# EAGLE design JMPM 001 (EAGLE 9.6.1)
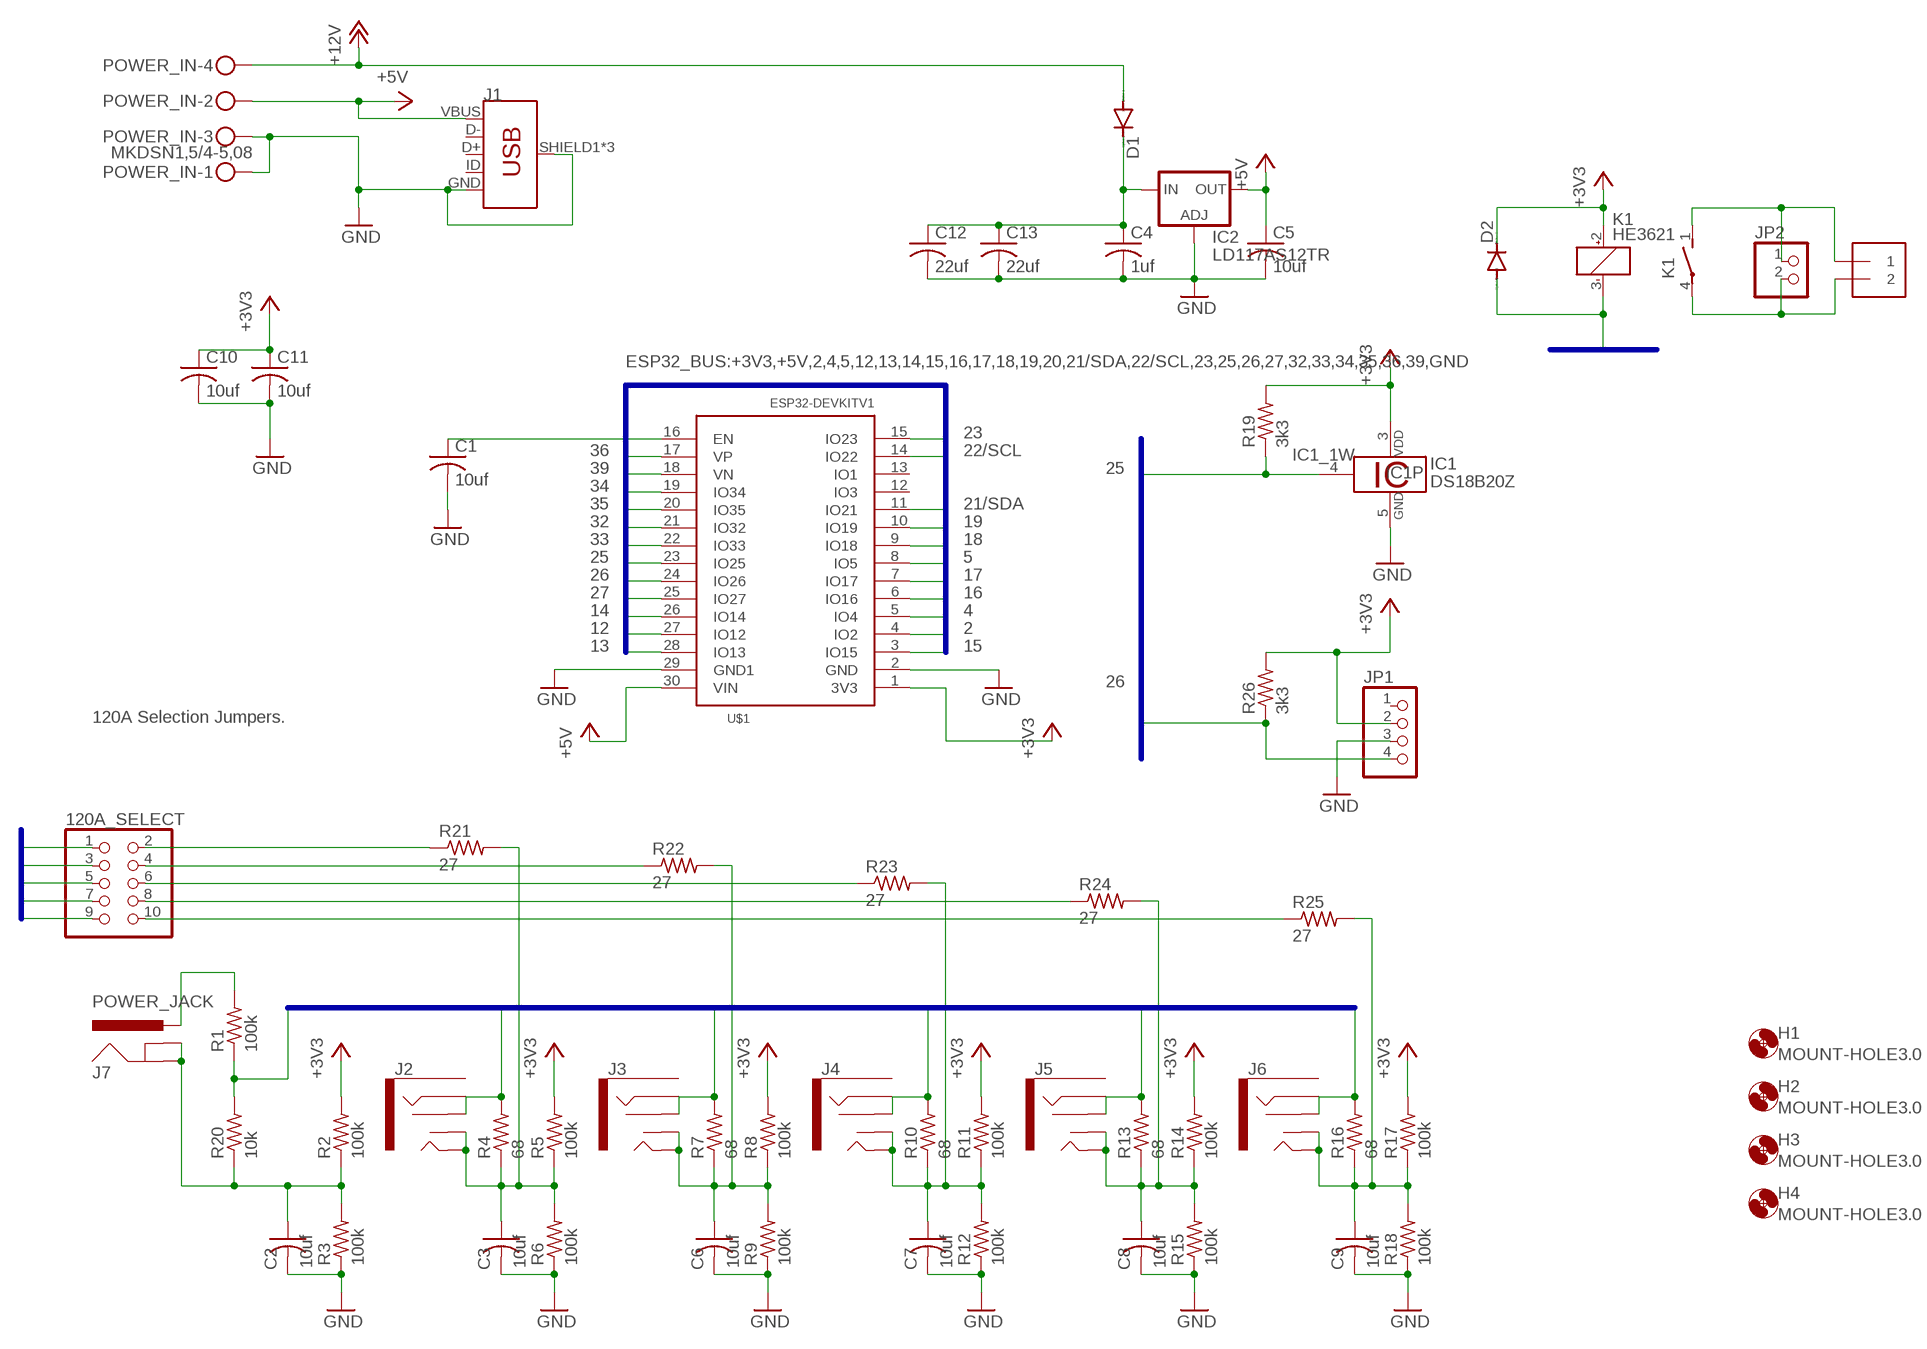
[diagram p0: schematic, sheet 1]

## Parts
120A_SELECT  PINHD-2X5  [2X05]
C1  10uf  C-USC0603  [C0603]
C2  10uf  C-USC0603  [C0603]
C3  10uf  C-USC0603  [C0603]
C4  1uf  C-USC0603  [C0603]
C5  10uf  C-USC0603  [C0603]
C6  10uf  C-USC0603  [C0603]
C7  10uf  C-USC0603  [C0603]
C8  10uf  C-USC0603  [C0603]
C9  10uf  C-USC0603  [C0603]
C10  10uf  C-USC0603  [C0603]
C11  10uf  C-USC0603  [C0603]
C12  22uf  C-USC0805  [C0805]
C13  22uf  C-USC0805  [C0805]
D1  DIODE-DO-214AC  [DO-214AC]
D2  DIODE-DO-214AC  [DO-214AC]
H1  MOUNT-HOLE3.0  [3,0]
H2  MOUNT-HOLE3.0  [3,0]
H3  MOUNT-HOLE3.0  [3,0]
H4  MOUNT-HOLE3.0  [3,0]
IC1  DS18B20Z  [SO08]
IC2  LD117AS12TR  [SOT223]
J1  USB_MICRO-BREDUCED_PASTE  [USB-B-MICRO-SMD_RED_PASTE]
J2  AUDIO_JACK_3.5MM_KIT  [AUDIO-JACK-KIT]
J3  AUDIO_JACK_3.5MM_KIT  [AUDIO-JACK-KIT]
J4  AUDIO_JACK_3.5MM_KIT  [AUDIO-JACK-KIT]
J5  AUDIO_JACK_3.5MM_KIT  [AUDIO-JACK-KIT]
J6  AUDIO_JACK_3.5MM_KIT  [AUDIO-JACK-KIT]
J7  POWER_JACK  [POWER_JACK_PTH]
JP1  PINHD-1X4/90  [1X04/90]
JP2  PINHD-1X2  [1X02]
JP2B  1X2-3.5MM  [1X2-3.5MM]
K1  HE3621  [HE3621]
POWER_IN  MKDSN1,5/4-5,08  [MKDSN1,5/4-5,08]
R1  100k  R-US_R0603  [R0603]
R2  100k  R-US_R0603  [R0603]
R3  100k  R-US_R0603  [R0603]
R4  68  R-US_R0603  [R0603]
R5  100k  R-US_R0603  [R0603]
R6  100k  R-US_R0603  [R0603]
R7  68  R-US_R0603  [R0603]
R8  100k  R-US_R0603  [R0603]
R9  100k  R-US_R0603  [R0603]
R10  68  R-US_R0603  [R0603]
R11  100k  R-US_R0603  [R0603]
R12  100k  R-US_R0603  [R0603]
R13  68  R-US_R0603  [R0603]
R14  100k  R-US_R0603  [R0603]
R15  100k  R-US_R0603  [R0603]
R16  68  R-US_R0603  [R0603]
R17  100k  R-US_R0603  [R0603]
R18  100k  R-US_R0603  [R0603]
R19  3k3  R-US_R0603  [R0603]
R20  10k  R-US_R0603  [R0603]
R21  27  R-US_R0603  [R0603]
R22  27  R-US_R0603  [R0603]
R23  27  R-US_R0603  [R0603]
R24  27  R-US_R0603  [R0603]
R25  27  R-US_R0603  [R0603]
R26  3k3  R-US_R0603  [R0603]
U$1  ESP32DEVKITV1  [ESP32-DEVKITV1]

## Nets
2: U$1.4(IO2)
4: U$1.5(IO4)
5: U$1.8(IO5)
12: U$1.27(IO12)
13: U$1.28(IO13)
14: U$1.26(IO14)
15: U$1.3(IO15)
16: U$1.6(IO16)
17: U$1.7(IO17)
18: U$1.9(IO18)
19: U$1.10(IO19)
21/SDA: U$1.11(IO21)
22/SCL: U$1.14(IO22)
23: U$1.15(IO23)
25: IC1.4 R19.1 U$1.23(IO25)
26: JP1.4 R26.1 U$1.24(IO26)
27: D2.A K1.3(1:-) U$1.25(IO27)
32: 120A_SELECT.7 J5.RING J5.RSH R13.2 U$1.21(IO32)
33: 120A_SELECT.9 J6.RING J6.RSH R16.2 U$1.22(IO33)
34: 120A_SELECT.3 J3.RING J3.RSH R7.2 U$1.19(IO34)
35: 120A_SELECT.5 J4.RING J4.RSH R10.2 U$1.20(IO35)
36: R1.1 R20.2 U$1.17(VP)
39: 120A_SELECT.1 J2.RING J2.RSH R4.2 U$1.18(VN)
+3V3 [3V3]: C10.1 C11.1 D2.C IC1.3 JP1.2 K1.2(1:+) R2.2 R5.2 R8.2 R11.2 R14.2 R17.2 R19.2 R26.2 U$1.1(3V3)
+5V [5V]: C5.1 IC2.4(OUT) J1.VBUS POWER_IN.2 U$1.30(VIN)
+12V [12V]: D1.A POWER_IN.4
GND [GND]: C1.2 C2.2 C3.2 C4.2 C5.2 C6.2 C7.2 C8.2 C9.2 C10.2 C11.2 C12.2 C13.2 IC1.5 IC2.1(ADJ) J1.GND J1.SHIELD1(SHIELD) J1.SHIELD2(SHIELD) J1.SHIELD3(SHIELD) JP1.3 POWER_IN.1 POWER_IN.3 R3.1 R6.1 R9.1 R12.1 R15.1 R18.1 U$1.2(GND) U$1.29(GND1)
N$1: C1.1 U$1.16(EN)
N$2 [12V]: C4.1 C12.1 C13.1 D1.C IC2.3(IN)
N$3: J7.PWR R1.2
N$4: JP2.1 JP2B.1 K1.1(2:S)
N$5: 120A_SELECT.2 R21.1
N$6: C2.1 J7.GND J7.GNDBREAK R2.1 R3.2 R20.1
N$7: 120A_SELECT.4 R22.1
N$8: C6.1 J3.TIP J3.TSH R7.1 R8.1 R9.2 R22.2
N$9: 120A_SELECT.6 R23.1
N$10: C7.1 J4.TIP J4.TSH R10.1 R11.1 R12.2 R23.2
N$11: 120A_SELECT.8 R24.1
N$12: C8.1 J5.TIP J5.TSH R13.1 R14.1 R15.2 R24.2
N$13: 120A_SELECT.10 R25.1
N$14: C9.1 J6.TIP J6.TSH R16.1 R17.1 R18.2 R25.2
N$15: C3.1 J2.TIP J2.TSH R4.1 R5.1 R6.2 R21.2
N$16: JP2.2 JP2B.2 K1.4(2:P)
Unconnected: J1.D+ J1.D- J1.ID J2.SLEEVE J3.SLEEVE J4.SLEEVE J5.SLEEVE J6.SLEEVE JP1.1 U$1.12(IO3) U$1.13(IO1)

## Buses
ESP32_BUS:+3V3,+5V,2,4,5,12,13,14,15,16,17,18,19,20,21/SDA,22/SCL,23,25,26,27,32,33,34,35,36,39,GND

## Notes on the sheet
- 120A Selection Jumpers.

## Library data of the parts
120A_SELECT = pinhead:PINHD-2X5: PIN HEADER
C1-C3 C5-C11 = rcl:C-US: CAPACITOR, American symbol; LCSC_PART_NUMBER: C19702; SPICEPREFIX: C
C4 = rcl:C-US: CAPACITOR, American symbol; LCSC_PART_NUMBER: C15849; SPICEPREFIX: C
C12 C13 = rcl:C-US: CAPACITOR, American symbol; LCSC_PART_NUMBER: C45783; SPICEPREFIX: C
D1 D2 = diode:DIODE-: DIODE; LCSC_PART_NUMBER: C95872
H1-H4 = holes:MOUNT-HOLE: MOUNTING HOLE with drill center marker
IC1 = 1wire:DS18B20: Programmable Resolution Digital Thermometer This chip provides a onewire thermosensor with approx. 0.5°C accuracy. A programmable over/undertemperure alarm is available. The precision can be set from 9..12 bits. Notes: Vdd must be applied for accurate measurements at low temperatures, as the parasite power circuit otherwise heats the sensor. If parasite power is used, Vdd has to be connected to GND. The DS1822 is a low-cost thermometer chip, the DS18S20 is similar to the DS18B20, but with 9 Bit precision only. Author: Jan Kandziora <jjj@gmx.de>; LCSC_PART_NUMBER: C97190
IC2 = v-reg:LD117A?*: Low drop fixed and adjustable positive voltage regulators 1 A Source: http://www.st.com/stonline/products/literature/ds/7194/ld1117axx.pdf; ALT: LDL1117S50R‎; LCSC_PART_NUMBER: C6187; PRICE: 0.5
J1 = SparkFun-Connectors:USB_MICRO-B: USB Type Micro-B Connector Male/female and PTH/SMT variants SparkFun Products: SparkFun microB USB Breakout <https://www.sparkfun.com/products/12035> SparkFun USB microB Plug Breakout <https://www.sparkfun.com/products/10031> SparkFun ESP8266 Thing <https://www.sparkfun.com/products/13231>; PROD_ID: CONN-11752
J2-J6 = SparkFun-Connectors:AUDIO_JACK_3.5MM: Audio Jack 3.5mm variants of PTH and SMT stereo audio jack with bypass switches. SparkFun Products: SparkFun SparkPunk Sound Kit <[https://www.sparkfun.com/products/11177]> - PTH MP3 Trigger <https://www.sparkfun.com/products/13720> -3.5mm SMD SparkFun PicoBoard <https://www.sparkfun.com/products/11888>- 2.5mm SMD; PROD_ID: CONN-08774; SF_ID: PRT-08032
J7 = SparkFun-Connectors:POWER_JACK: Power Jack Connector This is the standard 5.5mm barrel jack for power. The PTH is the most common, proven, reliable, footprint. The Slot footprint only works if the mill layer is transmitted to the PCB fab house so be warned. Here are the connectors we sell at SparkFun: DC Barrel Power Jack/Connector <https://www.sparkfun.com/products/119> (PRT-00119) DC Barrel Power Jack/Connector (SMD) <https://www.sparkfun.com/products/12748> (PRT-12748) DC Barrel Jack Adapter - Breadboard Compatible <https://www.sparkfun.com/products/10811> (PRT-10811) It is used on this SparkFun product (and many, many others): SparkFun RedBoard - Programmed with Arduino <https://www.sparkfun.com/products/12757> (DEV-12757) Also, if you need a mating power supply or connector, please check these out: Wall Adapter Power Supply - 9VDC 650mA <https://www.sparkfun.com/products/298> (TOL-00298) DC Barrel Jack Adapter - Male <https://www.sparkfun.com/products/10287> (PRT-10287); PROD_ID: CONN-08197
JP1 = pinhead:PINHD-1X4: PIN HEADER
JP2 = pinhead:PINHD-1X2: PIN HEADER
JP2B = adafruit:1X2: 3.5mm Terminal block http://www.ladyada.net/library/pcb/eaglelibrary.html; MPN: OSTTE020161
K1 = relay:HE3621: RELAY reed, 1 x norm. open, grid 5.08 mm, Hamlin; MF: HAMLIN; MPN: HE3621A0510; OC_FARNELL: 9561943; OC_NEWARK: 50F7993
POWER_IN = con-phoenix-508:MKDSN1,5/4-5,08: MKDSN 1,5/ 4-5,08 Printklemme Nennstrom: 13,5 A Nennspannung: 250 V Rastermaß: 5,08 mm Polzahl: 4 Anschlussart: Schraubanschluss Montage: Löten Anschlussrichtung Leiter/Platine: 0 ° Artikelnummer: 1729144 Source: http://eshop.phoenixcontact.com .. 1729144.pdf
R1-R3 R5 R6 R8 R9 R11 R12 R14 R15 R17 R18 = rcl:R-US_: RESISTOR, American symbol; LCSC_PART_NUMBER: C25803; SPICEPREFIX: R
R4 R7 R10 R13 R16 = rcl:R-US_: RESISTOR, American symbol; LCSC_PART_NUMBER: C27592; SPICEPREFIX: R
R19 R26 = rcl:R-US_: RESISTOR, American symbol; LCSC_PART_NUMBER: C22978; SPICEPREFIX: R
R20 = rcl:R-US_: RESISTOR, American symbol; LCSC_PART_NUMBER: C25804; SPICEPREFIX: R
R21-R25 = rcl:R-US_: RESISTOR, American symbol; LCSC_PART_NUMBER: C25190; SPICEPREFIX: R
U$1 = ESP32-DEVKITV1:ESP32DEVKITV1

## Net classes
0 default: width 0.305 mm, clearance 0.356 mm
1 GND: width 0.508 mm, clearance 0.356 mm
2 12V: width 0.61 mm, clearance 0.356 mm
3 5V: width 0.508 mm, clearance 0.356 mm
4 3V3: width 0.61 mm, clearance 0.356 mm

## Board
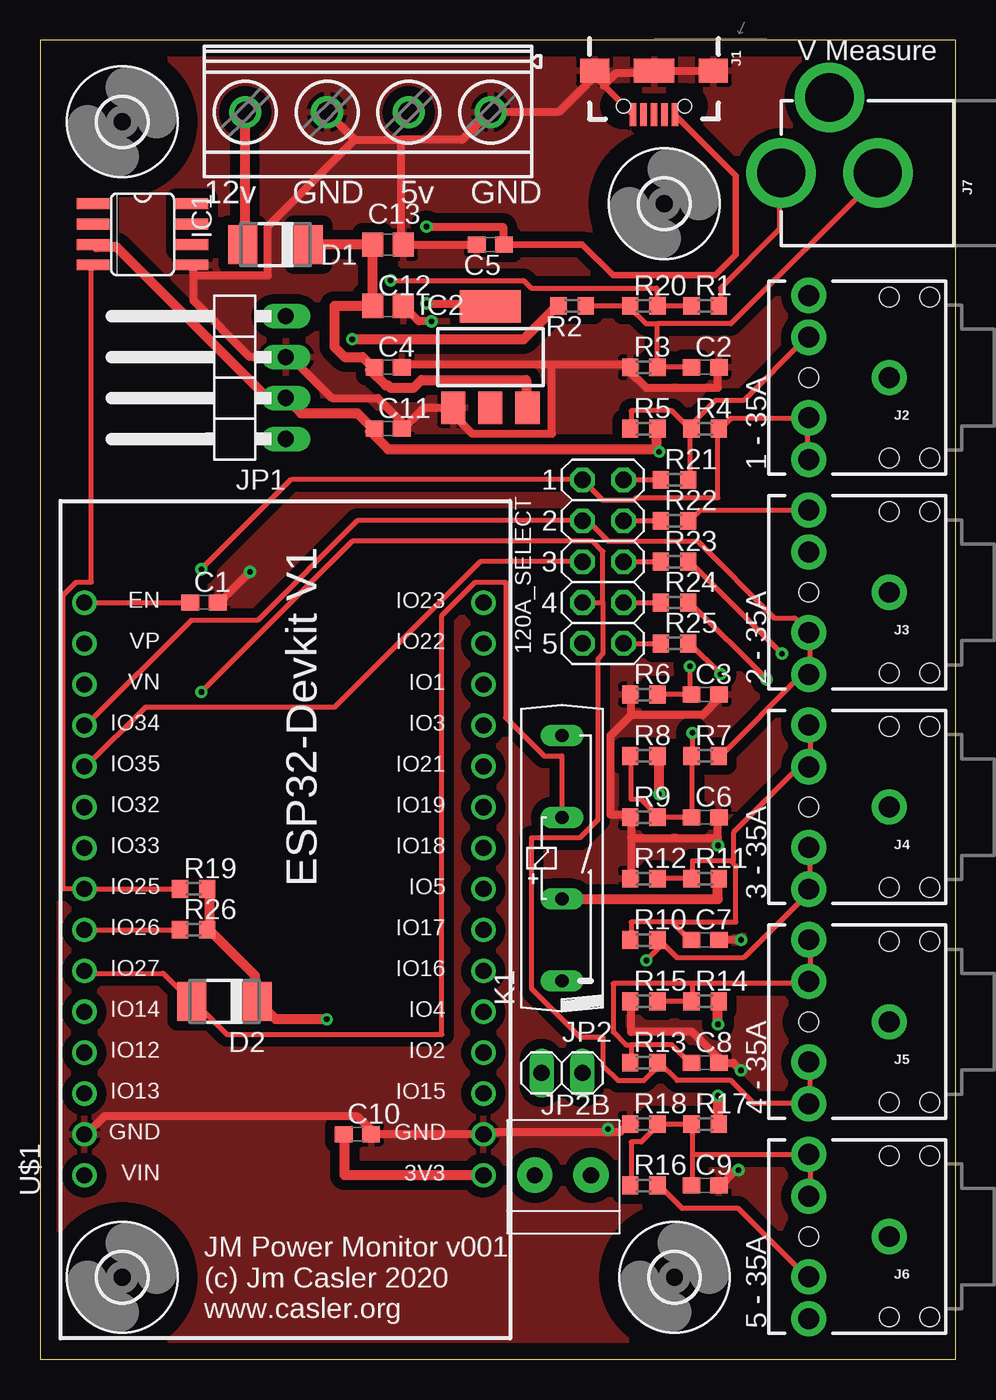
[diagram p1: board, top side]
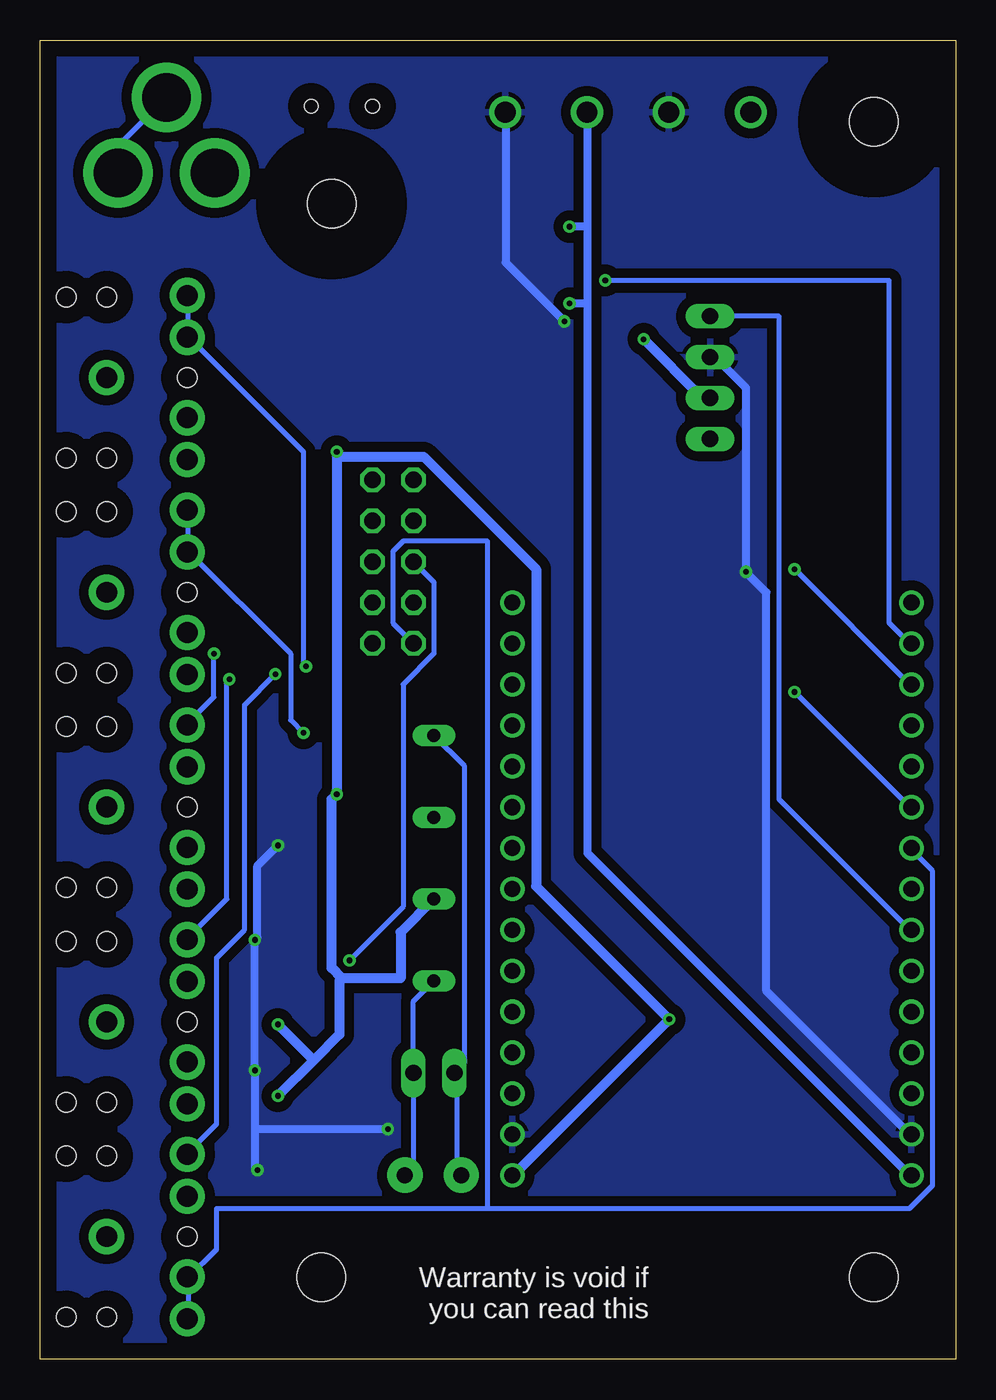
[diagram p2: board, bottom side, seen from below]

Size 56.82 x 81.91 mm. Coordinates in mm from the lower left corner, seen from the top.
Outline: 0,0 56.82,0 56.82,81.91 0,81.91 0,0
Copper layers (1*16): Top 0.035mm / dielectric 1.5mm / Bottom 0.035mm
Design rules "default *": minimum track width 6mil, minimum drill 0.35mm, track to track 6mil, track to pad 6mil, pad to pad 6mil, via to via 6mil, smd to smd 6mil, copper to edge 40mil, drill to drill 6mil, minimum pad ring 10mil, minimum via ring 8mil, stop-mask expansion 4mil, vias tented up to drill 20mil, thermal gap 10mil

### Footprints (pad centres in the part's own frame; a part is rotated, then mirrored left to right if it is on the bottom)
2X05 = drill 1.016 octagon: 1 -5.08,-1.27; 2 -5.08,1.27; 3 -2.54,-1.27; 4 -2.54,1.27; 5 0,-1.27; 6 0,1.27; 7 2.54,-1.27; 8 2.54,1.27; 9 5.08,-1.27; 10 5.08,1.27
C0603 = smd 1.1 x 1: 1 -0.85,0; 2 0.85,0
C0805 = smd 1.3 x 1.5: 1 -0.95,0; 2 0.95,0
DO-214AC = smd 1.8 x 2.4: A 2.025,0; C -2.025,0
3,0 = hole 3: 0,0
SO08 = smd 0.66 x 2.032: 1 -1.905,-3.073; 2 -0.635,-3.073; 3 0.635,-3.073; 4 1.905,-3.073; 5 1.905,3.073; 6 0.635,3.073; 7 -0.635,3.073; 8 -1.905,3.073
SOT223 = smd 1.5 x 2: 1 -2.3,-3.15; 2 0,-3.15; 3 2.3,-3.15 | smd 3.8 x 2: 4 0,3.15
USB-B-MICRO-SMD_RED_PASTE = smd 1.45 x 0.4: D+ 2.725,0; D- 2.725,0.65; GND 2.725,-1.3; ID 2.725,-0.65; VBUS 2.725,1.3 | smd 1.5 x 1.8: SHIELD1 0,3.685; SHIELD2 0,-3.685 | smd 1.5 x 2.5: SHIELD3 0,0 | hole 0.85: 2.2,1.9; 2.2,-1.9
AUDIO-JACK-KIT = drill 1.3 pad 2.184: RING 5,5.1; RSH 5,2.5; SLEEVE 0,0; TIP 5,-5.1; TSH 5,-2.5 | hole 1.2: 0,5; -2.5,5; -2.5,-5; 0,-5; 5,0
POWER_JACK_PTH = drill 2.997 pad 4.318: GND 0,7.7; GNDBREAK 4.7,10.7; PWR 0,13.7
1X04/90 = drill 1.016 long: 1 -3.81,-3.81; 2 -1.27,-3.81; 3 1.27,-3.81; 4 3.81,-3.81
1X02 = drill 1.016 long: 1 -1.27,0; 2 1.27,0
1X2-3.5MM = drill 1 pad 2.184: 1 1.8,0; 2 -1.7,0
HE3621 = drill 0.813 long: 1 -7.62,0; 2 -2.54,0; 3 2.54,0; 4 7.62,0
MKDSN1,5/4-5,08 = drill 1.3 pad 2: 1 -7.641,0.025; 2 -2.561,0.025; 3 2.519,0.025; 4 7.599,0.025
R0603 = smd 1 x 1.1: 1 -0.85,0; 2 0.85,0
ESP32-DEVKITV1 = drill 1 pad 1.422: 1 -22.87,-13.54; 2 -20.33,-13.54; 3 -17.79,-13.54; 4 -15.25,-13.54; 5 -12.71,-13.54; 6 -10.17,-13.54; 7 -7.63,-13.54; 8 -5.09,-13.54; 9 -2.55,-13.54; 10 -0.01,-13.54; 11 2.53,-13.54; 12 5.07,-13.54; 13 7.61,-13.54; 14 10.15,-13.54; 15 12.69,-13.54; 16 12.69,11.23; 17 10.15,11.23; 18 7.61,11.23; 19 5.07,11.23; 20 2.53,11.23; 21 -0.01,11.23; 22 -2.55,11.23; 23 -5.09,11.23; 24 -7.63,11.23; 25 -10.17,11.23; 26 -12.71,11.23; 27 -15.25,11.23; 28 -17.79,11.23; 29 -20.33,11.23; 30 -22.87,11.23

### Placement (x,y rotation side)
120A_SELECT  34.92,49.53 270 top
C1  10.16,46.99 0 top
C2  41.27,61.59 0 top
C3  41.27,41.27 0 top
C4  21.59,61.59 0 top
C5  27.94,69.22 180 top
C6  41.27,33.66 0 top
C7  41.27,26.04 0 top
C8  41.27,18.41 0 top
C9  41.27,10.79 0 top
C10  19.68,13.97 0 top
C11  21.59,57.78 0 top
C12  21.59,65.41 0 top
C13  21.59,69.22 0 top
D1  14.61,69.22 180 top
D2  11.43,22.23 180 top
H1  39.37,5.08 0 top
H2  38.73,71.75 0 top
H3  5.08,76.83 0 top
H4  5.08,5.08 0 top
IC1  6.35,69.85 270 top
IC2  27.94,62.23 0 top
J1  38.1,80.01 270 top
J2  52.7,60.96 180 top
J3  52.7,47.62 180 top
J4  52.7,34.29 180 top
J5  52.7,20.95 180 top
J6  52.7,7.62 180 top
J7  59.69,73.66 90 top
JP1  11.43,60.96 90 top
JP2  32.38,17.78 180 top
JP2B  32.38,11.43 0 top
K1  32.38,31.11 90 top
POWER_IN  20.32,77.47 180 top
R1  41.27,65.41 0 top
R2  33.02,65.41 180 top
R3  37.47,61.59 0 top
R4  41.27,57.78 0 top
R5  37.47,57.78 0 top
R6  37.47,41.27 0 top
R7  41.27,37.47 0 top
R8  37.47,37.47 0 top
R9  37.47,33.66 0 top
R10  37.47,26.04 0 top
R11  41.27,29.84 0 top
R12  37.47,29.84 0 top
R13  37.47,18.41 0 top
R14  41.27,22.23 0 top
R15  37.47,22.23 0 top
R16  37.47,10.79 0 top
R17  41.27,14.61 0 top
R18  37.47,14.61 0 top
R19  9.53,29.21 0 top
R20  37.47,65.41 0 top
R21  39.37,54.61 0 top
R22  39.37,52.07 0 top
R23  39.37,49.53 0 top
R24  39.37,46.99 0 top
R25  39.37,44.45 0 top
R26  9.53,26.67 0 top
U$1  13.97,34.29 90 top

### Tracks (layer width: path | path; a pad name or v marks a point on that pad's centre or on a via)
25
  Top 0.305: R19.1 2.86,29.21 U$1.23 2.7,29.21 1.43,29.21 1.43,47.47 2.22,48.26 3.17,48.26 3.17,67.94 IC1.4
26
  Top 0.305: R26.1 2.86,26.67 U$1.24
  Bottom 0.305: JP1.4 10.95,64.77 10.95,34.77 2.86,26.67 U$1.24
27
  Top 0.305: U$1.25 2.86,23.97 7.62,23.97 9.37,22.23 D2.A 9.53,22.23 11.59,20.16 24.92,20.16 24.92,46.2 26.99,48.26 28.89,48.26 28.89,39.85 31.27,37.47 32.38,37.47 K1.3
32  (via drill 0.35)
  Top 0.305: J5.RSH 47.78,18.41 47.78,15.88 J5.RING 47.62,15.88 44.29,15.88 42.86,17.3 39.53,17.3 38.42,18.41 R13.2 38.42,18.26 37.47,17.3 35.88,17.3 34.92,18.26 34.92,20 33.5,20 30.48,23.02 30.48,32.38 33.5,32.38 34.61,33.5 34.61,43.5 34.92,43.81 34.92,46.99 | v10,41.43 19.37,50.8 34.29,50.8 34.92,50.16 34.92,46.99 | 120A_SELECT.7 34.92,46.99
  Bottom 0.305: v10,41.43 2.86,34.29 U$1.21
33
  Top 0.305: R16.2 38.42,10.79 39.85,9.37 43.34,9.37 47.47,5.24 47.62,5.24 J6.RSH
  Bottom 0.305: 29.05,9.37 45.88,9.37 45.88,6.83 47.62,5.08 J6.RSH 47.62,4.92 47.62,2.54 J6.RING | 29.05,9.37 2.86,9.37 1.43,10.79 1.43,30.32 2.7,31.59 U$1.22 | 120A_SELECT.9 34.92,45.72 34.92,50.16 34.29,50.8 29.05,50.8 29.05,9.37
34
  Top 0.305: R7.2 42.23,37.47 47.15,42.39 47.62,42.39 J3.RING 47.78,42.55 47.78,45.09 J3.RSH 47.62,45.24 46.83,46.04 45.56,46.04 40.8,50.8 35.24,50.8 33.97,52.07 120A_SELECT.3 19.68,52.07 13.49,45.88 9.37,45.88 2.86,39.37 U$1.19
35  (via drill 0.35)
  Top 0.305: J4.RSH 47.78,31.75 47.78,29.21 J4.RING 47.78,29.05 43.66,24.92 39.53,24.92 38.42,26.04 R10.2 38.58,25.72 v37.62,24.77 | 120A_SELECT.5 27.3,49.53 18.26,40.48 6.51,40.48 2.86,36.83 U$1.20
  Bottom 0.305: v37.62,24.77 34.29,28.1 34.29,41.91 32.38,43.81 32.38,48.26 120A_SELECT.5
36  (via drill 0.35)
  Top 0.305: R1.1 R20.2 38.26,65.41 38.26,66.52 30.48,66.52 30,66.99 v21.75,66.99
  Bottom 0.305: v21.75,66.99 4.13,66.99 4.13,45.72 2.86,44.45 U$1.17
39  (via drill 0.35)
  Top 0.305: J2.RING 47.62,55.88 47.62,58.26 J2.RSH 47.62,58.42 42.86,58.42 42.23,57.78 R4.2 42.07,57.78 42.07,53.5 36.99,53.5 36.83,53.34 34.92,53.34 120A_SELECT.1 15.56,54.61 v10,49.05
  Bottom 0.305: v10,49.05 2.86,41.91 U$1.18
+3V3  (via drill 0.35)
  Top 0.61: R19.2 10.48,29.21 10.48,26.67 R26.2 10.64,26.51 13.34,23.81 13.34,22.23 D2.C 13.65,22.07 14.61,21.11 v17.78,21.11 | C10.1 18.89,13.97 18.89,11.43 27.46,11.43 U$1.1 | v38.42,35.08 38.42,37.47 R8.2 | v42.07,16.35 42.07,14.61 R17.2 | v42.07,20.8 42.07,22.23 R14.2 | K1.2 42.07,28.57 42.07,29.84 R11.2 | v19.37,63.34 30,63.34 32.07,65.41 R2.2 | 38.26,56.52 38.26,57.78 R5.2 | 38.26,56.52 21.59,56.52 20.48,57.63 C11.1 20.64,57.78 19.68,58.74 16.19,58.74 JP1.2 15.08,59.85 13.97,59.85 4.76,69.06 3.49,69.06 3.33,69.22 IC1.3 | v38.42,56.36 38.26,56.52
  Bottom 0.61: U$1.1 27.46,11.43 v17.78,21.11 26.04,29.37 26.04,49.05 33.02,56.04 38.26,56.04 v38.42,56.36 v38.42,35.08 38.73,34.77 38.73,24.29 38.1,23.65 | 38.1,23.65 34.45,23.65 34.45,26.51 K1.2 | 39.85,18.57 38.26,20.16 38.26,23.5 38.1,23.65 | 39.85,18.57 v42.07,16.35 | 39.85,18.57 v42.07,20.8 | v19.37,63.34 15.72,59.69 JP1.2
+5V  (via drill 0.35)
  Top 0.406: J1.VBUS 43.18,73.5 43.18,68.58 41.91,67.31 35.56,67.31 33.66,69.22 C5.1
  Top 0.508: v23.97,65.56 27.78,65.56 27.94,65.41 IC2.4 | v23.97,70.33 28.73,70.33 28.73,69.37 C5.1
  Bottom 0.508: 22.86,70.33 22.86,77.31 POWER_IN.2 | 22.86,70.33 22.86,65.56 | 22.86,65.56 22.86,31.43 2.86,11.43 U$1.30 | 22.86,65.56 v23.97,65.56 | 22.86,70.33 v23.97,70.33
+12V
  Top 0.61: D1.A 12.7,69.22 12.7,77.31 POWER_IN.4
GND  (via drill 0.35)
  Top 0.406: J1.GND 34.98,79.11 34.41,79.67 J1.SHIELD2
  Top 0.508: C5.2 C13.2 22.38,69.37 22.38,75.72 | 19.53,75.72 22.38,75.72 | 19.53,75.72 17.94,77.31 POWER_IN.3 | J1.SHIELD1 J1.SHIELD3 37.94,79.85 35.72,79.85 34.98,79.11 | v24.29,64.45 23.5,64.45 C12.2 | J1.SHIELD2 34.29,79.53 32.23,77.47 28.1,77.47 POWER_IN.1 27.78,77.31 26.19,75.72 22.38,75.72 | 31.75,61.75 36.35,61.75 36.51,61.59 R3.1 36.51,61.44 37.62,60.33 42.07,60.33 42.07,61.59 C2.2 | 31.75,61.75 22.7,61.75 22.54,61.59 C4.2 | v13.02,48.9 11.11,46.99 C1.2 | 9.53,67.31 9.53,65.72 13.02,62.23 JP1.3 15.4,62.07 15.72,62.07 18.1,59.69 20.95,59.69 22.54,58.1 C11.2 22.54,57.78 23.81,59.05 25.56,59.05 IC2.1 25.4,58.9 26.83,57.47 31.75,57.47 31.75,61.75 | 9.53,67.31 9.53,67.94 IC1.5 | 19.53,75.72 14.13,70.33 14.13,67.31 9.53,67.31 | 36.67,40.01 36.67,41.27 R6.1 | 36.67,40.01 41.12,40.01 42.07,40.96 42.07,41.27 C3.2 | 36.67,32.38 36.67,33.66 R9.1 36.51,33.81 35.4,33.81 35.4,38.73 36.67,40.01 | 36.67,32.38 36.67,29.84 R12.1 | 42.07,32.38 42.07,33.66 C6.2 | 36.67,32.38 42.07,32.38 | v43.34,11.75 43.18,11.75 42.23,10.79 C9.2 | v43.5,17.94 43.02,18.41 C8.2 42.23,18.57 40.48,20.32 36.67,20.32 36.67,22.23 R15.1 | v43.5,26.04 C7.2 | v42.07,31.91 42.07,32.38 | 35.24,14.13 27.62,14.13 U$1.2 27.46,13.97 C10.2 20.64,14.13 19.68,15.08 3.97,15.08 2.86,13.97 U$1.29 | 35.24,14.13 36.04,14.13 36.51,14.61 R18.1 | v35.24,14.29 35.24,14.13
  Bottom 0.508: v24.29,64.45 27.94,68.1 27.94,77.31 POWER_IN.1 | JP1.3 14.92,62.23 13.02,60.33 v13.02,48.9 11.75,47.62 11.75,22.86 2.86,13.97 U$1.29 | v43.34,11.75 43.5,11.91 43.5,14.29 | 43.5,14.29 v43.5,17.94 v43.5,26.04 43.34,26.19 43.34,30.64 v42.07,31.91 | v35.24,14.29 43.5,14.29
  pour Bottom (isolate 0.61): -0.64,82.55 57.15,82.55 57.15,0 -0.64,0
  pour Top (isolate 0.61): -1.27,83.19 57.78,83.19 57.78,-0.64 -1.27,-0.64
N$1
  Top 0.305: C1.1 2.86,46.99 U$1.16
N$2
  Top 0.61: IC2.3 30.16,59.21 30.16,60.8 23.65,60.8 23.18,60.33 21.75,60.33 21.59,60.48 21.43,60.48 20.48,61.44 C4.1 20.64,61.59 20,62.23 18.89,62.23 18.26,62.87 18.26,65.41 C12.1 20.64,65.56 C13.1 D1.C
N$3
  Top 0.305: R1.2 42.23,65.41 42.23,66.52 45.88,70.17 45.88,73.66 J7.PWR
N$4
  Bottom 0.305: K1.1 33.66,22.23 JP2.1 33.66,11.91 34.13,11.43 JP2B.1
N$5
  Top 0.305: 120A_SELECT.2 R21.1
N$6
  Top 0.305: C2.1 R3.2 38.26,61.59 38.26,64.29 | 36.51,65.41 R2.1 | 38.26,64.29 37.62,64.29 36.51,65.41 | 36.51,65.41 R20.1 | 38.26,64.29 42.86,64.29 51.91,73.34 51.91,73.66 J7.GND
  Bottom 0.305: J7.GNDBREAK 49.05,78.26 51.91,75.41 51.91,73.66 J7.GND
N$7
  Top 0.305: 120A_SELECT.4 R22.1
N$8  (via drill 0.35)
  Top 0.305: R22.2 40.32,52.07 40.96,52.7 47.62,52.7 J3.TIP | 38.42,33.66 C6.1 40.48,33.66 40.48,37.47 | 38.42,33.66 37.31,34.77 36.67,34.77 36.67,37.47 R8.1 | 38.42,33.66 R9.2 | v40.48,38.89 40.48,37.47 | 40.48,37.47 R7.1
  Bottom 0.305: v40.48,38.89 41.27,39.69 41.27,43.81 47.62,50.16 J3.TSH 47.62,50.32 47.62,52.7 J3.TIP
N$9
  Top 0.305: 120A_SELECT.6 R23.1
N$10  (via drill 0.35)
  Top 0.305: R12.2 R11.1 40.48,29.84 40.48,30.96 42.86,30.96 42.94,30.88 | 39.29,27.07 40.32,26.04 C7.1 | 39.29,27.07 39.21,27.15 36.67,27.15 36.67,26.04 R10.1 | 42.94,30.88 43.18,30.64 43.18,27.15 39.37,27.15 39.29,27.07 | v46.04,43.81 40.32,49.53 R23.2 | J4.TIP 47.78,39.37 47.78,36.83 J4.TSH 47.62,36.67 46.99,36.67 43.02,32.7 43.02,30.96 42.94,30.88
  Bottom 0.305: v46.04,43.81 46.04,41.12 47.62,39.53 J4.TIP
N$11
  Top 0.305: 120A_SELECT.8 R24.1
N$12  (via drill 0.35)
  Top 0.305: 36.67,19.53 36.67,18.41 R13.1 | 36.67,19.53 39.21,19.53 40.32,18.41 C8.1 | R15.2 R14.1 40.48,22.23 40.48,23.34 | 40.48,23.34 47.62,23.34 J5.TSH 47.78,23.5 47.78,26.04 J5.TIP | 36.67,19.53 36.35,19.53 35.56,20.32 35.56,23.34 40.48,23.34 | v45.09,42.23 40.32,46.99 R24.2
  Bottom 0.305: v45.09,42.23 45.24,42.07 45.24,28.57 47.62,26.19 J5.TIP
N$13
  Top 0.305: 120A_SELECT.10 R25.1
N$14  (via drill 0.35)
  Top 0.305: 40.48,12.7 40.48,14.61 R17.1 38.42,14.61 | 40.48,12.7 40.48,10.79 C9.1 | 38.42,14.61 37.31,13.49 36.67,13.49 36.67,10.79 R16.1 | 38.42,14.61 R18.2 | v42.23,42.55 40.32,44.45 R25.2 | 40.48,12.7 47.62,12.7 J6.TIP 47.78,12.7 47.78,10.16 J6.TSH
  Bottom 0.305: v42.23,42.55 44.13,40.64 44.13,26.67 45.88,24.92 45.88,14.61 47.62,12.86 J6.TIP
N$15  (via drill 0.35)
  Top 0.305: 40.32,57.78 39.21,58.9 36.67,58.9 36.67,57.78 R5.1 | 40.32,57.78 40.32,54.61 R21.2 | 40.32,57.78 R4.1 40.32,57.94 41.91,59.53 43.66,59.53 47.47,63.34 47.62,63.34 J2.TSH | 40.32,41.27 R6.2 | v40.32,43.02 40.32,41.27 | 40.32,41.27 C3.1
  Bottom 0.305: v40.32,43.02 40.48,43.18 40.48,56.36 47.62,63.5 J2.TSH 47.62,63.66 47.62,66.04 J2.TIP
N$16
  Bottom 0.305: K1.4 30.48,36.83 30.48,18.41 JP2.2 30.96,17.78 30.96,11.59 30.8,11.43 JP2B.2

### Text on the board
tPlace: 12v GND 5v GND
tNames: V Measure | 1 - 35A | 1 / 2 / 3 / 4 / 5 | 2 - 35A | 3 - 35A | 4 - 35A | JM Power Monitor v001 / (c) Jm Casler 2020 / www.casler.org | 5 - 35A
bNames: Warranty is void if / you can read this
tValues: *